# Altium schematic sheet polynomial_distribution.SchDoc
size A
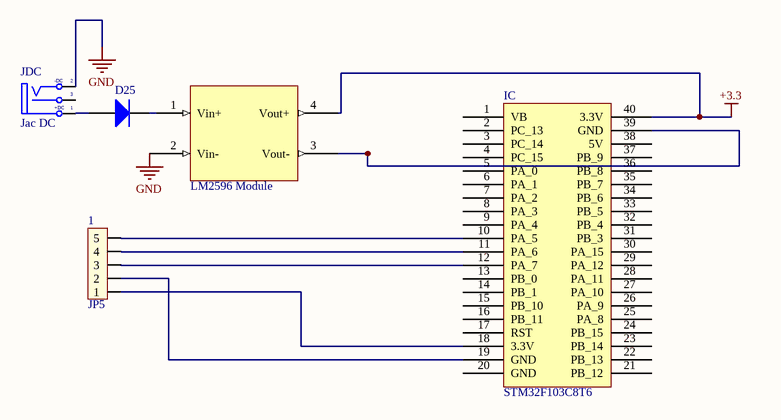
[diagram p0: polynomial_distribution.SchDoc]

## Parts
1  JP5  [JP5]
?  LM2596 Module  [LM2596 Module]
D25  Diode  [D0.5A]  (value not drawn)
IC  STM32F103C8T6  [DIP40/W0.6]
JDC  Jac DC  [DC-IN]

## Nets
+3.3: ?.4(Vout+) IC.40(3.3V)
GND: ?.2(Vin-) JDC.2(TN)
Net1_1: 1.1 IC.18(3.3V)
Net1_2: 1.2 IC.19(GND)
Net1_3: 1.3 IC.12(PA_7)
Net1_4: 1.4 IC.11(PA_6)
Net1_5: 1.5 IC.10(PA_5)
Net?_1: ?.1(Vin+) D25.2(K)
Net?_3: ?.3(Vout-) IC.39(GND)
NetD25_1: D25.1(A) JDC.1(T)

Not connected (* = marked no-connect by the designer): IC 1(VB) 2(PC_13) 3(PC_14) 4(PC_15) 5(PA_0) 6(PA_1) 7(PA_2) 8(PA_3) 9(PA_4) 13(PB_0) 14(PB_1) 15(PB_10) 16(PB_11) 17(RST) 20(GND) 21(PB_12) 22(PB_13) 23(PB_14) 24(PB_15) 25(PA_8) 26(PA_9) 27(PA_10) 28(PA_11) 29(PA_12) 30(PA_15) 31(PB_3) 32(PB_4) 33(PB_5) 34(PB_6) 35(PB_7) 36(PB_8) 37(PB_9) 38(5V); JDC 3(S)

## Notes on the sheet
- (in symbol DCIN) -DC; +DC

## Library data of the parts
D25 = Diode: Default Diode; Code - JEDEC: DO-214-AB; Value: 1N5007; Published: 8-Jun-2000; Revision: July-2002: Re-released for DXP Platform.; Publisher: Altium Limited
JDC = DCIN: Jac DC input; Value: Jac DC